# Altium schematic sheet XPT20461_XPT2046.schdoc
size 127 x 101 mm
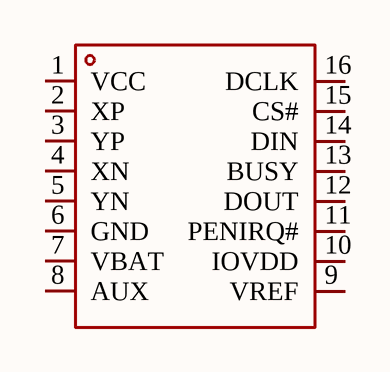
[diagram p0: XPT20461_XPT2046.schdoc]

## Parts
U?  XPT2046  [TSSOP-16_L5.0-W4.4-P0.65-LS6.4-BL]  (value not drawn)

## Nets

Not connected (* = marked no-connect by the designer): U? 1(VCC) 2(XP) 3(YP) 4(XN) 5(YN) 6(GND) 7(VBAT) 8(AUX) 9(VREF) 10(IOVDD) 11(PENIRQ#) 12(DOUT) 13(BUSY) 14(DIN) 15(CS#) 16(DCLK)

## Library data of the parts
U? = XPT2046: Manufacturer: XPT(矽普特); Add into BOM: yes; Symbol: XPT2046; Device: XPT2046; LCSC Part Name: XPT2046; Supplier Part: C19076; Manufacturer Part: XPT2046; Supplier Footprint: TSSOP-16; JLCPCB Part Class: Extended Part; Datasheet: https://item.szlcsc.com/datasheet/XPT2046/19779.html; Supplier: LCSC; Convert to PCB: yes; Touch Screen Type: -; Interface: -